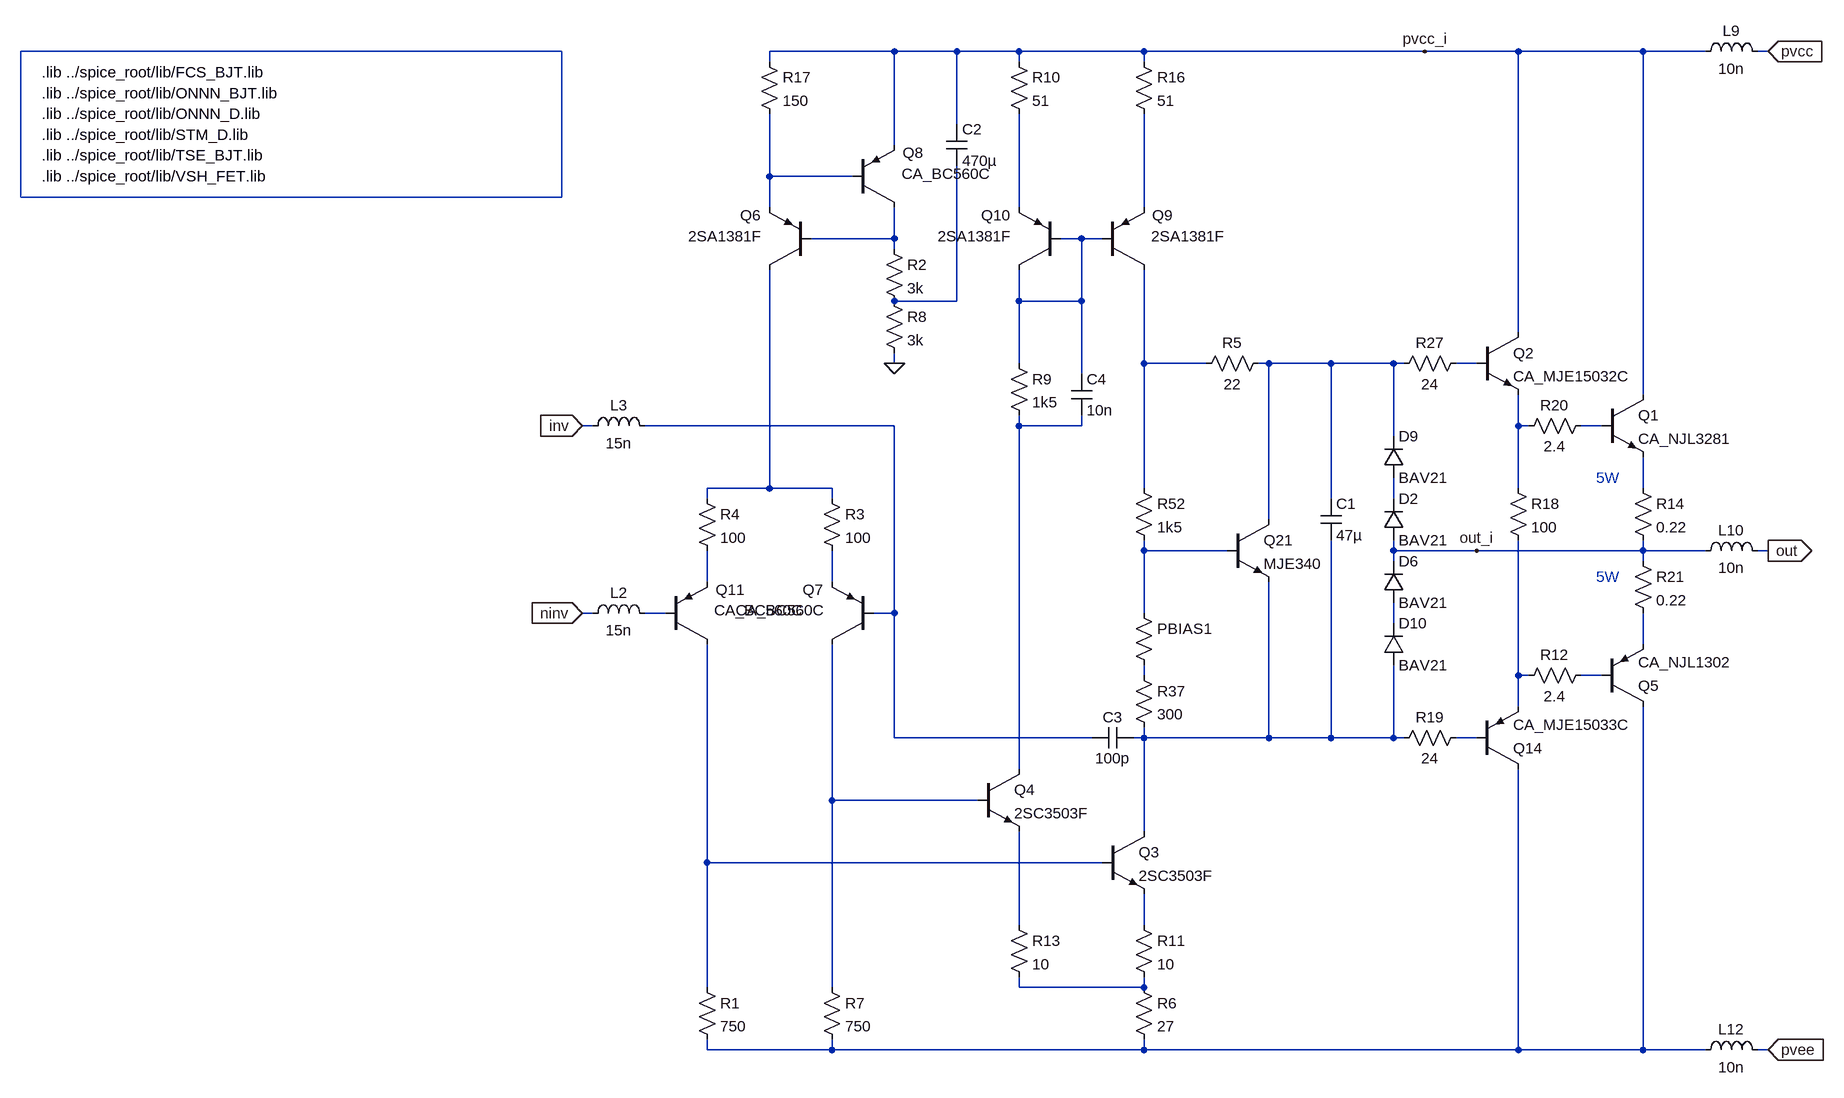
[diagram p0: schematic pab3bbb-compact-module.asc]
pab3bbb-compact-module.asc, the LTspice schematic file:
Version 4
SHEET 1 6124 2336
WIRE 448 -992 256 -992
WIRE 544 -992 448 -992
WIRE 640 -992 544 -992
WIRE 832 -992 640 -992
WIRE 1264 -992 832 -992
WIRE 1408 -992 1264 -992
WIRE 1600 -992 1408 -992
WIRE 1696 -992 1600 -992
WIRE 1792 -992 1776 -992
WIRE 256 -976 256 -992
WIRE 640 -976 640 -992
WIRE 832 -976 832 -992
WIRE 544 -880 544 -992
WIRE 448 -848 448 -992
WIRE 256 -800 256 -896
WIRE 384 -800 256 -800
WIRE 256 -752 256 -800
WIRE 640 -752 640 -896
WIRE 832 -752 832 -896
WIRE 448 -704 448 -752
WIRE 448 -704 320 -704
WIRE 736 -704 704 -704
WIRE 768 -704 736 -704
WIRE 448 -688 448 -704
WIRE 544 -608 544 -816
WIRE 544 -608 448 -608
WIRE 640 -608 640 -656
WIRE 736 -608 736 -704
WIRE 736 -608 640 -608
WIRE 1408 -560 1408 -992
WIRE 448 -512 448 -528
WIRE 640 -512 640 -608
WIRE 832 -512 832 -656
WIRE 928 -512 832 -512
WIRE 1024 -512 1008 -512
WIRE 1120 -512 1024 -512
WIRE 1216 -512 1120 -512
WIRE 1232 -512 1216 -512
WIRE 1344 -512 1312 -512
WIRE 736 -496 736 -608
WIRE 1600 -464 1600 -992
WIRE -16 -416 -32 -416
WIRE 448 -416 64 -416
WIRE 640 -416 640 -432
WIRE 736 -416 736 -432
WIRE 736 -416 640 -416
WIRE 1408 -416 1408 -464
WIRE 1424 -416 1408 -416
WIRE 1536 -416 1504 -416
WIRE 1216 -400 1216 -512
WIRE 256 -320 256 -656
WIRE 256 -320 160 -320
WIRE 352 -320 256 -320
WIRE 832 -320 832 -512
WIRE 1408 -320 1408 -416
WIRE 1600 -320 1600 -368
WIRE 160 -304 160 -320
WIRE 352 -304 352 -320
WIRE 1120 -304 1120 -512
WIRE 1216 -304 1216 -336
WIRE 1024 -272 1024 -512
WIRE 832 -224 832 -240
WIRE 960 -224 832 -224
WIRE 1216 -224 1216 -240
WIRE 1344 -224 1216 -224
WIRE 1600 -224 1600 -240
WIRE 1600 -224 1344 -224
WIRE 1696 -224 1600 -224
WIRE 1792 -224 1776 -224
WIRE 1216 -208 1216 -224
WIRE 1600 -208 1600 -224
WIRE 160 -176 160 -224
WIRE 352 -176 352 -224
WIRE -16 -128 -32 -128
WIRE 96 -128 64 -128
WIRE 448 -128 448 -416
WIRE 448 -128 416 -128
WIRE 832 -128 832 -224
WIRE 1216 -112 1216 -144
WIRE 1600 -80 1600 -128
WIRE 832 -32 832 -48
WIRE 1408 -32 1408 -240
WIRE 1424 -32 1408 -32
WIRE 1536 -32 1504 -32
WIRE 1408 16 1408 -32
WIRE 448 64 448 -128
WIRE 752 64 448 64
WIRE 832 64 832 48
WIRE 832 64 816 64
WIRE 1024 64 1024 -176
WIRE 1024 64 832 64
WIRE 1120 64 1120 -240
WIRE 1120 64 1024 64
WIRE 1216 64 1216 -48
WIRE 1216 64 1120 64
WIRE 1232 64 1216 64
WIRE 1344 64 1312 64
WIRE 640 112 640 -416
WIRE 352 160 352 -80
WIRE 576 160 352 160
WIRE 832 208 832 64
WIRE 160 256 160 -80
WIRE 768 256 160 256
WIRE 640 352 640 208
WIRE 832 352 832 304
WIRE 160 448 160 256
WIRE 352 448 352 160
WIRE 640 448 640 432
WIRE 832 448 832 432
WIRE 832 448 640 448
WIRE 160 544 160 528
WIRE 352 544 352 528
WIRE 352 544 160 544
WIRE 832 544 832 528
WIRE 832 544 352 544
WIRE 1408 544 1408 112
WIRE 1408 544 832 544
WIRE 1600 544 1600 16
WIRE 1600 544 1408 544
WIRE 1696 544 1600 544
WIRE 1792 544 1776 544
FLAG 1792 -992 pvcc
IOPIN 1792 -992 In
FLAG 1792 544 pvee
IOPIN 1792 544 In
FLAG 1792 -224 out
IOPIN 1792 -224 Out
FLAG -32 -128 ninv
IOPIN -32 -128 In
FLAG -32 -416 inv
IOPIN -32 -416 In
FLAG 1264 -992 pvcc_i
FLAG 1344 -224 out_i
FLAG 448 -512 0
SYMBOL pnp 96 -80 M180
WINDOW 0 77 84 Left 2
WINDOW 3 75 52 Left 2
SYMATTR InstName Q11
SYMATTR Value CA_BC560C
SYMBOL res 816 -992 R0
SYMATTR InstName R16
SYMATTR Value 51
SYMBOL res 1328 -528 R90
WINDOW 0 0 56 VBottom 2
WINDOW 3 32 56 VTop 2
SYMATTR InstName R27
SYMATTR Value 24
SYMBOL res 816 -144 R0
WINDOW 3 36 76 Invisible 2
SYMATTR Value {1+(500*BIAS)}
SYMATTR InstName PBIAS1
SYMBOL res 816 -336 R0
SYMATTR InstName R52
SYMATTR Value 1k5
SYMBOL npn 768 208 R0
SYMATTR InstName Q3
SYMATTR Value 2SC3503F
SYMBOL res 816 432 R0
SYMATTR InstName R6
SYMATTR Value 27
SYMBOL pnp 416 -80 R180
WINDOW 0 77 84 Left 2
WINDOW 3 75 52 Left 2
SYMATTR InstName Q7
SYMATTR Value CA_BC560C
SYMBOL npn 960 -272 R0
SYMATTR InstName Q21
SYMATTR Value MJE340
SYMBOL res 816 -48 R0
SYMATTR InstName R37
SYMATTR Value 300
SYMBOL res 1584 -336 R0
SYMATTR InstName R14
SYMATTR Value 0.22
SYMBOL res 1584 -224 R0
SYMATTR InstName R21
SYMATTR Value 0.22
SYMBOL ind -32 -112 R270
WINDOW 0 32 56 VTop 2
WINDOW 3 5 56 VBottom 2
SYMATTR InstName L2
SYMATTR Value 15n
SYMATTR SpiceLine Rser=20m
SYMBOL ind -32 -400 R270
WINDOW 0 32 56 VTop 2
WINDOW 3 5 56 VBottom 2
SYMATTR InstName L3
SYMATTR Value 15n
SYMATTR SpiceLine Rser=20m
SYMBOL ind 1680 -208 R270
WINDOW 0 32 56 VTop 2
WINDOW 3 5 56 VBottom 2
SYMATTR InstName L10
SYMATTR Value 10n
SYMATTR SpiceLine Rser=10m
SYMBOL ind 1680 -976 R270
WINDOW 0 32 56 VTop 2
WINDOW 3 5 56 VBottom 2
SYMATTR InstName L9
SYMATTR Value 10n
SYMATTR SpiceLine Rser=10m
SYMBOL ind 1680 560 R270
WINDOW 0 32 56 VTop 2
WINDOW 3 5 56 VBottom 2
SYMATTR InstName L12
SYMATTR Value 10n
SYMATTR SpiceLine Rser=10m
SYMBOL res 1328 48 R90
WINDOW 0 0 56 VBottom 2
WINDOW 3 32 56 VTop 2
SYMATTR InstName R19
SYMATTR Value 24
SYMBOL pnp 768 -656 M180
WINDOW 0 77 84 Left 2
WINDOW 3 75 52 Left 2
SYMATTR InstName Q9
SYMATTR Value 2SA1381F
SYMBOL diode 1200 -336 M180
WINDOW 0 24 64 Left 2
WINDOW 3 24 0 Left 2
SYMATTR InstName D9
SYMATTR Value BAV21
SYMBOL diode 1200 -48 M180
WINDOW 0 24 64 Left 2
WINDOW 3 24 0 Left 2
SYMATTR InstName D10
SYMATTR Value BAV21
SYMBOL cap 1104 -304 R0
SYMATTR InstName C1
SYMATTR Value 47µ
SYMATTR SpiceLine Rser=220m Lser=5n Rpar=800k Cpar=1p
SYMBOL res 144 -320 R0
SYMATTR InstName R4
SYMATTR Value 100
SYMBOL cap 816 48 R90
WINDOW 0 0 32 VBottom 2
WINDOW 3 32 32 VTop 2
SYMATTR InstName C3
SYMATTR Value 100p
SYMATTR SpiceLine Rser=970m Lser=5n Rpar=2meg Cpar=1p
SYMBOL res 336 -320 R0
SYMATTR InstName R3
SYMATTR Value 100
SYMBOL pnp 320 -656 R180
WINDOW 0 77 84 Left 2
WINDOW 3 75 52 Left 2
SYMATTR InstName Q6
SYMATTR Value 2SA1381F
SYMBOL res 432 -704 R0
SYMATTR InstName R2
SYMATTR Value 3k
SYMBOL res 240 -992 R0
SYMATTR InstName R17
SYMATTR Value 150
SYMBOL npn 1536 -464 R0
SYMATTR InstName Q1
SYMATTR Value CA_NJL3281
SYMBOL npn 1344 -560 R0
SYMATTR InstName Q2
SYMATTR Value CA_MJE15032C
SYMBOL pnp 1536 16 M180
SYMATTR InstName Q5
SYMATTR Value CA_NJL1302
SYMBOL pnp 1344 112 M180
SYMATTR InstName Q14
SYMATTR Value CA_MJE15033C
SYMBOL res 1024 -528 R90
WINDOW 0 0 56 VBottom 2
WINDOW 3 32 56 VTop 2
SYMATTR InstName R5
SYMATTR Value 22
SYMBOL cap 528 -880 R0
SYMATTR InstName C2
SYMATTR Value 470µ
SYMATTR SpiceLine Rser=112m Lser=5n Rpar=600k Cpar=1p
SYMBOL res 1392 -336 R0
SYMATTR InstName R18
SYMATTR Value 100
SYMBOL res 1520 -48 R90
WINDOW 0 0 56 VBottom 2
WINDOW 3 32 56 VTop 2
SYMATTR InstName R12
SYMATTR Value 2.4
SYMBOL res 1520 -432 R90
WINDOW 0 0 56 VBottom 2
WINDOW 3 32 56 VTop 2
SYMATTR InstName R20
SYMATTR Value 2.4
SYMBOL diode 1200 -240 M180
WINDOW 0 24 64 Left 2
WINDOW 3 24 0 Left 2
SYMATTR InstName D2
SYMATTR Value BAV21
SYMBOL diode 1200 -144 M180
WINDOW 0 24 64 Left 2
WINDOW 3 24 0 Left 2
SYMATTR InstName D6
SYMATTR Value BAV21
SYMBOL res 144 432 R0
SYMATTR InstName R1
SYMATTR Value 750
SYMBOL res 432 -624 R0
SYMATTR InstName R8
SYMATTR Value 3k
SYMBOL pnp 384 -752 M180
WINDOW 0 77 84 Left 2
WINDOW 3 75 52 Left 2
SYMATTR InstName Q8
SYMATTR Value CA_BC560C
SYMBOL res 336 432 R0
SYMATTR InstName R7
SYMATTR Value 750
SYMBOL npn 576 112 R0
SYMATTR InstName Q4
SYMATTR Value 2SC3503F
SYMBOL pnp 704 -656 R180
WINDOW 0 77 84 Left 2
WINDOW 3 75 52 Left 2
SYMATTR InstName Q10
SYMATTR Value 2SA1381F
SYMBOL res 624 -992 R0
SYMATTR InstName R10
SYMATTR Value 51
SYMBOL res 816 336 R0
SYMATTR InstName R11
SYMATTR Value 10
SYMBOL res 624 336 R0
SYMATTR InstName R13
SYMATTR Value 10
SYMBOL res 624 -528 R0
SYMATTR InstName R9
SYMATTR Value 1k5
SYMBOL cap 720 -496 R0
SYMATTR InstName C4
SYMATTR Value 10n
SYMATTR SpiceLine Rser=970m Lser=5n Rpar=2meg Cpar=1p
TEXT 1528 -336 Left 2 ;5W
TEXT 1528 -184 Left 2 ;5W
TEXT -864 -928 Left 2 !.lib ../spice_root/lib/ONNN_BJT.lib
TEXT -864 -864 Left 2 !.lib ../spice_root/lib/STM_D.lib
TEXT -864 -960 Left 2 !.lib ../spice_root/lib/FCS_BJT.lib
TEXT -864 -896 Left 2 !.lib ../spice_root/lib/ONNN_D.lib
TEXT -864 -832 Left 2 !.lib ../spice_root/lib/TSE_BJT.lib
TEXT -864 -800 Left 2 !.lib ../spice_root/lib/VSH_FET.lib
RECTANGLE Normal -64 -768 -896 -992

The netlist it stands for:
* pab3bbb-compact-module.asc
Q11 N029 N020 N018 0 CA_BC560C
R16 pvcc_i N003 51
R27 N009 N008 24
R§PBIAS1 N017 N023 {1+(500*BIAS)}
R52 N007 N017 1k5
Q3 N026 N029 N031 0 2SC3503F
R6 N032 N033 27
Q7 N028 N010 N019 0 CA_BC560C
Q21 N008 N017 N026 0 MJE340
R37 N023 N026 300
R14 N015 out_i 0.22
R21 out_i N022 0.22
L2 ninv N020 15n Rser=20m
L3 inv N010 15n Rser=20m
L10 out_i out 10n Rser=10m
L9 pvcc_i pvcc 10n Rser=10m
L12 N033 pvee 10n Rser=10m
R19 N027 N026 24
Q9 N007 N005 N003 0 2SA1381F
D9 N016 N008 BAV21
D10 N026 N021 BAV21
C1 N008 N026 47µ Rser=220m Lser=5n Rpar=800k Cpar=1p
R4 N014 N018 100
C3 N026 N010 100p Rser=970m Lser=5n Rpar=2meg Cpar=1p
R3 N014 N019 100
Q6 N014 N004 N001 0 2SA1381F
R2 N004 N006 3k
R17 pvcc_i N001 150
Q1 pvcc_i N013 N015 0 CA_NJL3281
Q2 pvcc_i N009 N012 0 CA_MJE15032C
Q5 N033 N025 N022 0 CA_NJL1302
Q14 N033 N027 N024 0 CA_MJE15033C
R5 N008 N007 22
C2 pvcc_i N006 470µ Rser=112m Lser=5n Rpar=600k Cpar=1p
R18 N012 N024 100
R12 N025 N024 2.4
R20 N013 N012 2.4
D2 out_i N016 BAV21
D6 N021 out_i BAV21
R1 N029 N033 750
R8 N006 0 3k
Q8 N004 N001 pvcc_i 0 CA_BC560C
R7 N028 N033 750
Q4 N011 N028 N030 0 2SC3503F
Q10 N005 N005 N002 0 2SA1381F
R10 pvcc_i N002 51
R11 N031 N032 10
R13 N030 N032 10
R9 N005 N011 1k5
C4 N005 N011 10n Rser=970m Lser=5n Rpar=2meg Cpar=1p
.model D D
.lib standard.dio
.model NPN NPN
.model PNP PNP
.lib standard.bjt
* 5W
* 5W
.lib ../spice_root/lib/ONNN_BJT.lib
.lib ../spice_root/lib/STM_D.lib
.lib ../spice_root/lib/FCS_BJT.lib
.lib ../spice_root/lib/ONNN_D.lib
.lib ../spice_root/lib/TSE_BJT.lib
.lib ../spice_root/lib/VSH_FET.lib
.backanno
.end